# Altium project NSTTL.PrjPCB
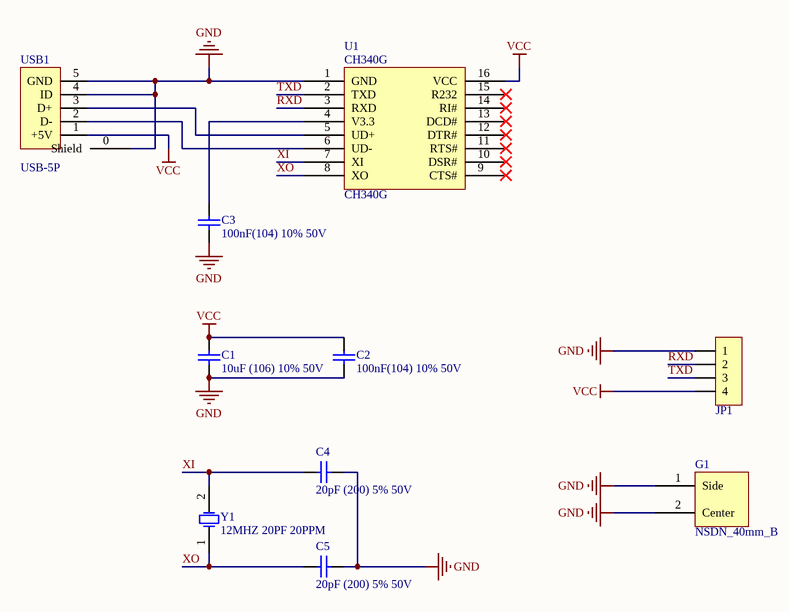
[diagram p0: NSTTL.SchDoc]
1 sheet, 10 parts. Net scope: global (net labels, ports and power ports of the same name join across sheets).
Board file: NSTTL.PcbDoc

## Sheet NSTTL.SchDoc
size A4

### Parts
C1  10uF (106) 10% 50V  [1206_C]
C2  100nF(104) 10% 50V  [0805_C]
C3  100nF(104) 10% 50V  [0805_C]
C4  20pF (200) 5% 50V  [0805_C]
C5  20pF (200) 5% 50V  [0805_C]
G1  NSDN_40mm_B  [NSDN_40mm_B]
JP1  HDR-1X4  [HDR2.54-WS-4P]  (value not drawn)
U1  CH340G  [SOIC-16_150mil]
USB1  USB-5P  [USB-MICRO_D]
Y1  12MHZ 20PF 20PPM  [SMD-5032_2P]

### Nets
GND: C1.2 C2.2 C3.2 C4.2 C5.1 G1.1(Side) G1.2(Center) JP1.1 U1.1(GND) USB1.0(Shield) USB1.4(ID) USB1.5(GND)
VCC: C1.1 C2.1 JP1.4 U1.16(VCC) USB1.1(+5V)
RXD: JP1.2 U1.3(RXD)
TXD: JP1.3 U1.2(TXD)
XI: C4.1 U1.7(XI) Y1.2(OSC2)
XO: C5.2 U1.8(XO) Y1.1(OSC1)
NetC3_1: C3.1 U1.4(V3.3)
NetU1_5: U1.5(UD+) USB1.3(D+)
NetU1_6: U1.6(UD-) USB1.2(D-)

Not connected (* = marked no-connect by the designer): U1 9(CTS#)* 10(DSR#)* 11(RTS#)* 12(DTR#)* 13(DCD#)* 14(RI#)* 15(R232)*

### Library data of the parts
C1 = 1206 10uF (106) 10% 50V: 贴片电容; ComponentLink1Description: 供应商链接; ComponentLink1URL: http://www.szlcsc.com/product/details_14236.html; Package: 1206; Supplier: LC; SuppliersPartNumber: C13585
C2 C3 = 0805 100nF(104) 10% 50V: 贴片电容; ComponentLink1Description: 供应商链接; ComponentLink1URL: http://www.szlcsc.com/product/details_50686.html; Package: 0805; Supplier: LC; SuppliersPartNumber: C49678
C4 C5 = 0805 20pF (200) 5% 50V: 贴片电容; ComponentLink1Description: 供应商链接; ComponentLink1URL: http://www.szlcsc.com/product/details_2150.html; Package: 0805; Supplier: LC; SuppliersPartNumber: C1798
JP1 = Header 4: 4P接插件; 版权归属: 源创客; BOM名称: 4P接插件; 学习资源: www.ooocke.com
U1 = CH340G_[C14267]: USB; ComponentLink1Description: 供应商链接; ComponentLink1URL: http://www.szlcsc.com/product/details_14927.html; Package: SOIC-16_150mil; Supplier: LC; SuppliersPartNumber: C14267
USB1 = USB-5P: 微型USB母座; 版权归属: 源创客; BOM名称: 微型USB母座; 学习资源: www.ooocke.com
Y1 = SMD-5032_2P 11.0592MHZ 20PF 20PPM: 贴片晶振; ComponentLink1Description: 供应商链接; ComponentLink1URL: http://www.szlcsc.com/product/details_53039.html; Package: SMD-5032_2P; Supplier: LC; SuppliersPartNumber: C52026